# Altium schematic sheet Sheet1.SchDoc
size A4; SheetNumber: 1; SheetTotal: 1
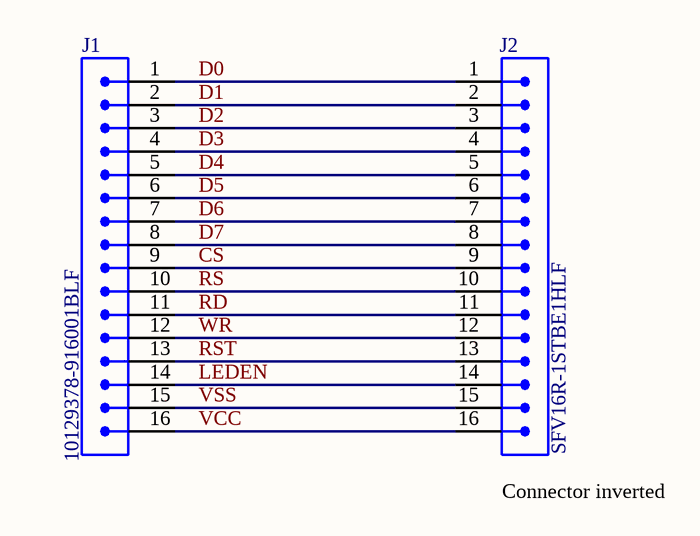
[diagram p0: Sheet1.SchDoc]

## Parts
J1  10129378-916001BLF  [16POS]
J2  SFV16R-1STBE1HLF  [FFC16POS]

## Nets
~{CS}: J1.9 J2.9
D0: J1.1 J2.1
D1: J1.2 J2.2
D2: J1.3 J2.3
D3: J1.4 J2.4
D4: J1.5 J2.5
D5: J1.6 J2.6
D6: J1.7 J2.7
D7: J1.8 J2.8
LEDEN: J1.14 J2.14
~{RD}: J1.11 J2.11
~{RS}: J1.10 J2.10
~{RST}: J1.13 J2.13
VCC: J1.16 J2.16
VSS: J1.15 J2.15
~{WR}: J1.12 J2.12

## Notes on the sheet
- (near J2) Connector inverted

## Library data of the parts
J1 = 10129378-916001BLF: Connector Header Through Hole 16 position 0.100" (2.54mm)
J2 = SFV16R-1STBE1HLF: 16 Position FFC, FPC Connector Contacts, Bottom 0.020" (0.50mm) Surface Mount, Right Angle